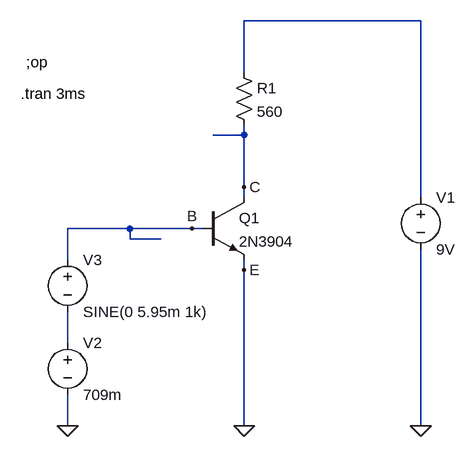
[diagram p0: schematic emitter.asc]
emitter.asc, the LTspice schematic file:
Version 4
SHEET 1 880 680
WIRE 480 -192 208 -192
WIRE 208 -112 208 -192
WIRE 208 -16 208 -32
WIRE 208 -16 160 -16
WIRE 208 64 208 -16
WIRE 208 80 208 64
WIRE 480 80 480 -192
WIRE 32 128 -64 128
WIRE 128 128 32 128
WIRE 144 128 128 128
WIRE 32 144 32 128
WIRE 80 144 32 144
WIRE -64 176 -64 128
WIRE 208 192 208 176
WIRE -64 304 -64 256
WIRE -64 432 -64 384
WIRE 208 432 208 192
WIRE 480 432 480 160
FLAG 208 432 0
FLAG 480 432 0
FLAG -64 432 0
FLAG 208 64 C
FLAG 208 192 E
FLAG 128 128 B
DATAFLAG -64 128 "Ib(Q1)"
DATAFLAG 80 144 ""
DATAFLAG 288 -192 "Ic(Q1)"
DATAFLAG 160 -16 ""
DATAFLAG 208 320 "Ie(Q1)"
SYMBOL npn 144 80 R0
SYMATTR InstName Q1
SYMATTR Value 2N3904
SYMBOL res 192 -128 R0
SYMATTR InstName R1
SYMATTR Value 560
SYMBOL voltage 480 64 R0
SYMATTR InstName V1
SYMATTR Value 9V
SYMBOL voltage -64 288 R0
WINDOW 123 0 0 Left 0
WINDOW 39 0 0 Left 0
SYMATTR InstName V2
SYMATTR Value 709m
SYMBOL voltage -64 160 R0
WINDOW 123 0 0 Left 0
WINDOW 39 0 0 Left 0
SYMATTR InstName V3
SYMATTR Value SINE(0 5.95m 1k)
TEXT -128 -128 Left 2 !;op
TEXT -136 -80 Left 2 !.tran 3ms

The netlist it stands for:
* emitter.asc
Q1 C B 0 0 2N3904
R1 N001 C 560
V1 N001 0 9V
V2 N002 0 709m
V3 B N002 SINE(0 5.95m 1k)
.model NPN NPN
.model PNP PNP
.lib standard.bjt
;op
.tran 3ms
.backanno
.end